# Altium schematic sheet XTIDA-010086_Bias Power Supply.SchDoc: Control card (part 2 of 2)
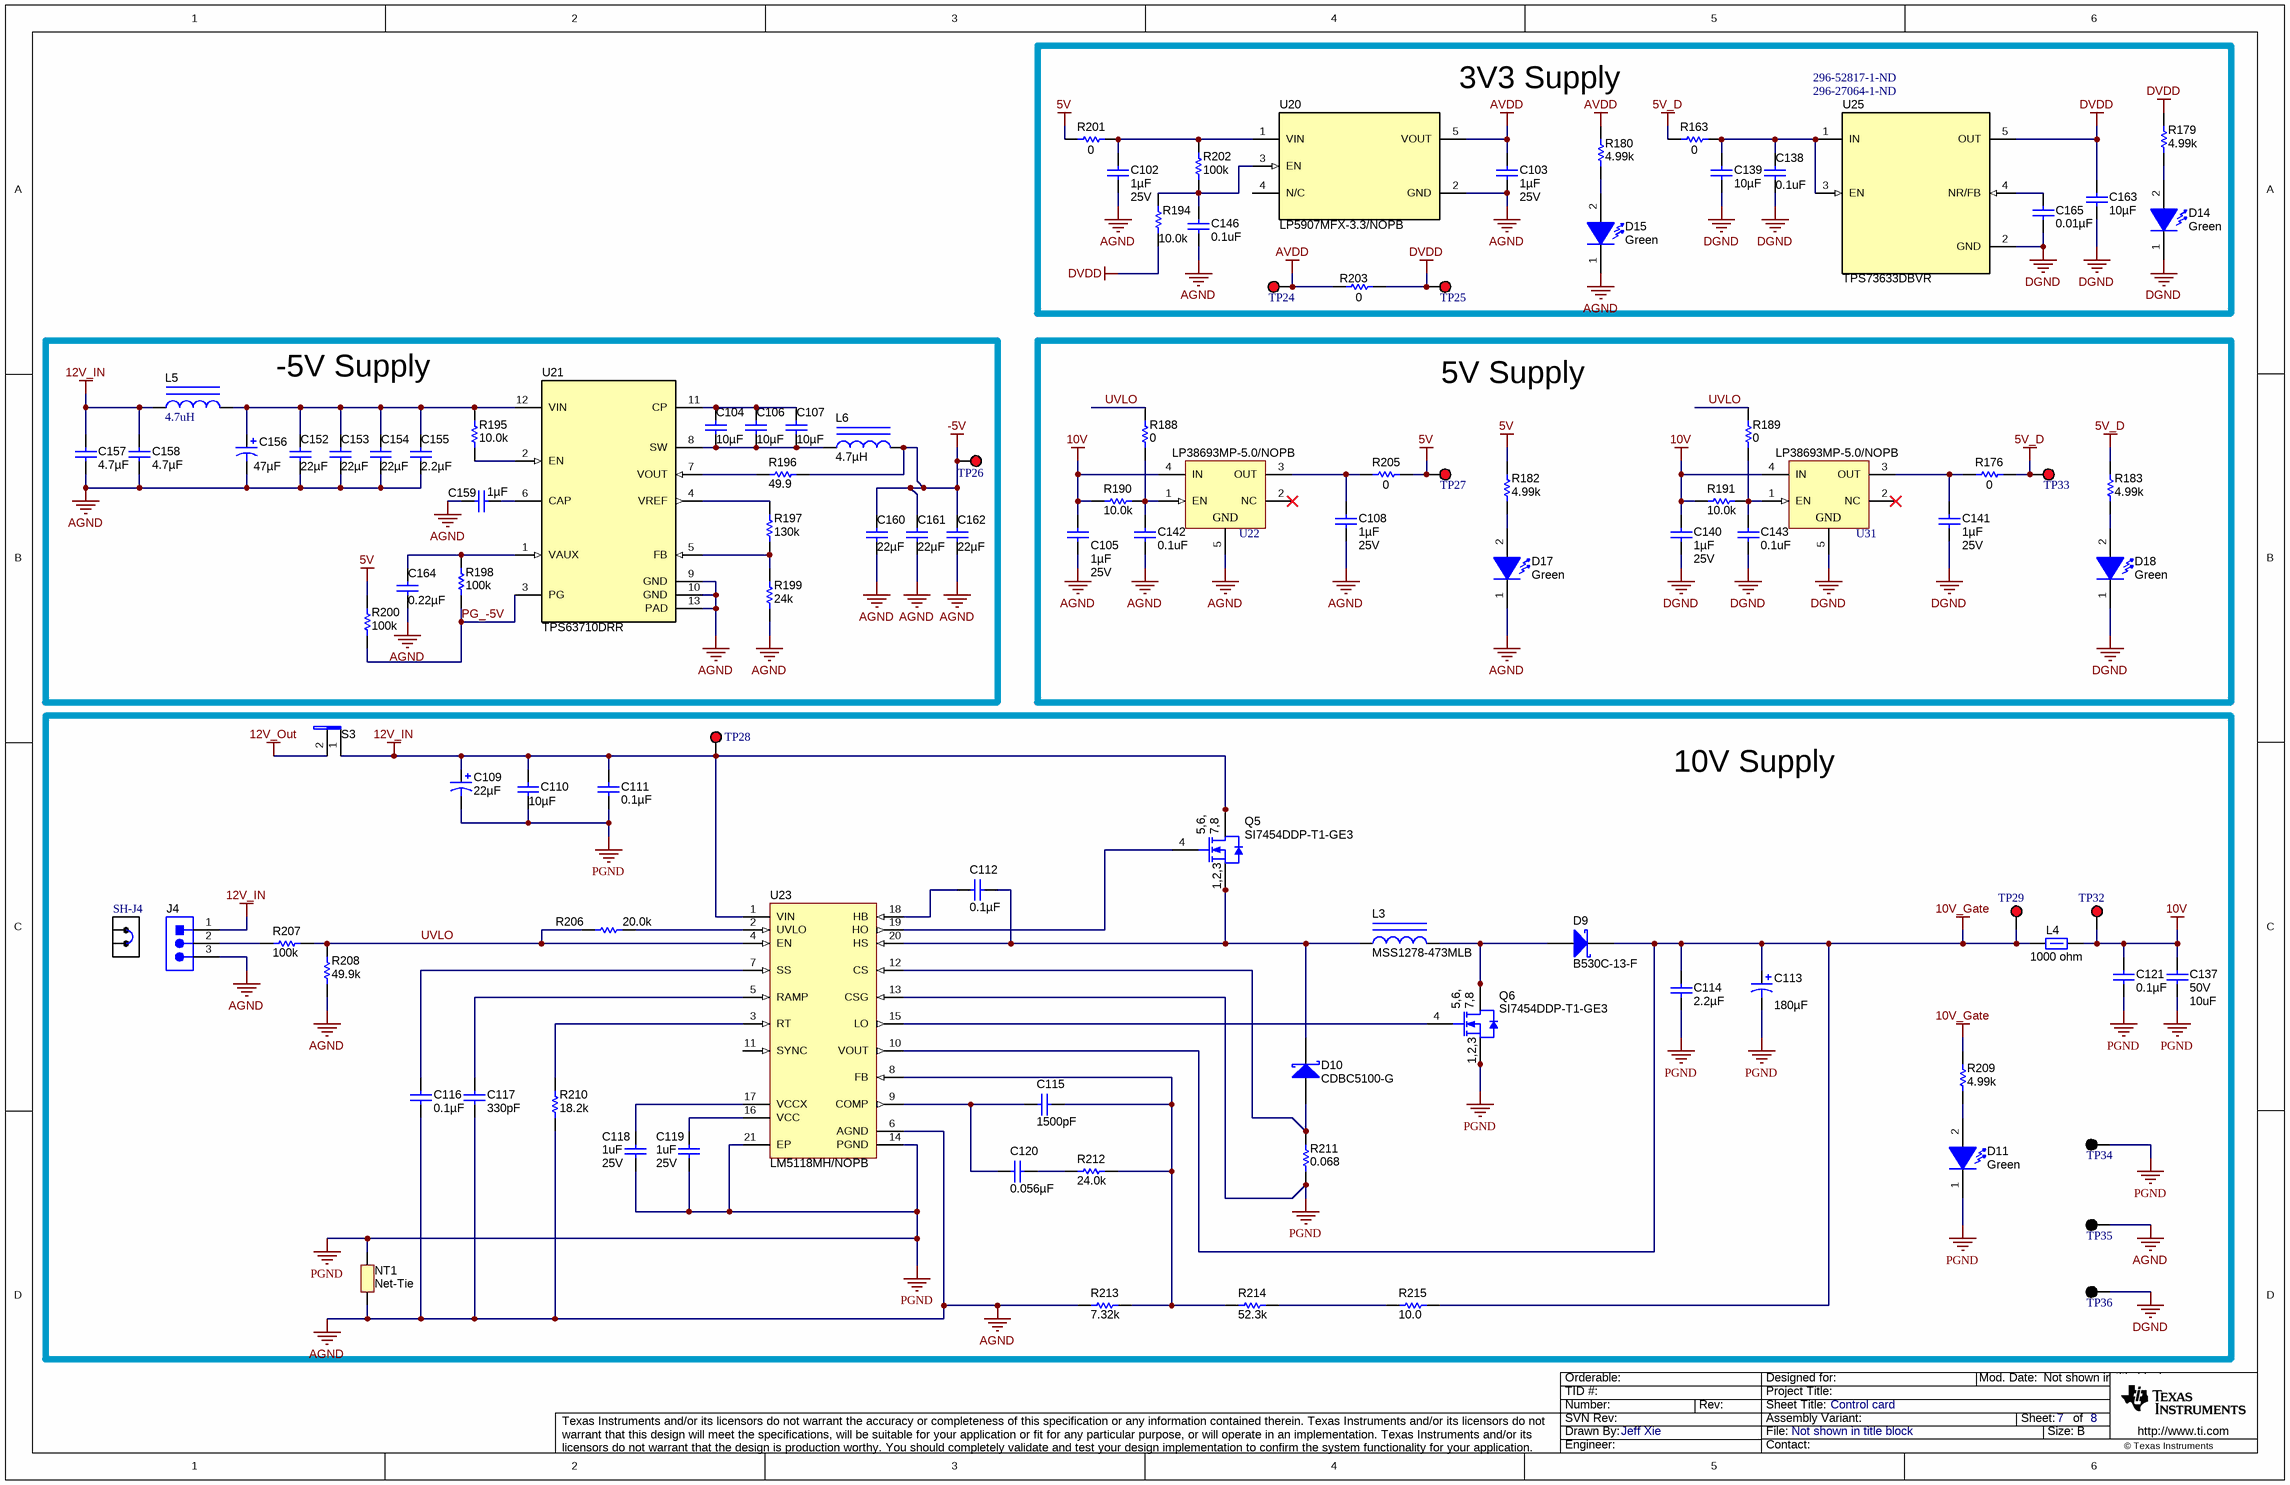
[diagram p1: XTIDA-010086_Bias Power Supply.SchDoc]

## Library data of the parts
C102 C103 C105 C108 C140 C141 = Capacitor: CAP, CERM, 1 uF, 25 V, +/- 10%, X7R, 0603; Manufacturer: MuRata; TaMin_C: -55°C; Polarized: N; SizeAreaWB_mm2: 4.68; Value1: Unknown; U/M: EA; Value: 1uF; TaMax_C: 125°C; SizeZ_mm: 1; SizeX_mm: 1.6; SizeY_mm: 0.8; SizeArea_mm2: 1.28; AEC Category: Q200; ComponentLink1URL: http://search.murata.co.jp/Ceramy/PnsearchViewAction.do?HnOFG=ON&HnNFG=ON&SEL_CNT=50&sLang=en&sKey=GRM188R71E105KA12D&x=9&y=9&search=startwith; Supplier Part Number 2: 81-GRM188R71E105KA2D; Publisher: Texas Instruments; Supplier 2: Mouser; Supplier Part Number 3: 1735540; TempCo: X7R; Supplier 3: Farnell; Published: 2008-06-19; RoHS: Y; MountType: SMT; Supplier 1: Digi-Key; PackageReference: 0603; Tolerance_%: 10%; Cap_Case: 0603; Value2: 25V; CompType: Capacitor; LatestRevisionDate: 2017-03-09; PartNumber: GRM188R71E105KA12D; AEC Qualified: ?; ComponentLink1Description: Datasheet link; Supplier Part Number 1: 490-5307-1-ND; Technology: Ceramic; ValueDisplayed: 1uF
C104 C106 C107 = EMK212BB7106MG-T: CAP, CERM, 10 µF, 16 V, +/- 20%, X7R, 0805; Manufacturer: Taiyo Yuden; Polarized: N; CompType: Capacitor; Value: 10uF; U/M: EA; Cap_F: 0.00001; Tolerance_%: 20; Value1: Unknown; VDC_V: 16; Value2: 16V; TaMin_C: -55; TaMax_C: 125; Cap_Case: 0805; AEC Category: Q200; SymbolVersion: 2008-07-09; PartNumber: EMK212BB7106MG-T; PackageReference: 0805; RoHS: Y; MountType: SMT; Technology: Ceramic; TempCo: X7R; Published: 2008-06-19; Publisher: Texas Instruments; LatestRevisionDate: 2016-03-15; ComponentLink1Description: Datasheet link; ComponentLink1URL: http://www.yuden.co.jp/productdata/catalog/en/mlcc_all_e.pdf; Supplier 1: Digi-Key; Supplier Part Number 1: 587-3319-1-ND; Supplier 2: Mouser; Supplier Part Number 2: 963-EMK212BB7106MG-T; AEC Qualified: ?
C109 = EMVH101ADA220MJA0G: CAP, AL, 22 µF, 100 V, +/- 20%, 0.55 ohm, SMD; Manufacturer: Chemi-Con; Polarized: Y; CompType: Capacitor; Value: 22uF; U/M: EA; Cap_F: 0.000022; Tolerance_%: 20; VDC_V: 100; Value2: 100V; ESR_ohm: 0.55; IRMS_A: 0.115; TaMin_C: -40; TaMax_C: 125; Cap_Case: JA0; SymbolVersion: 2008-07-09; PartNumber: EMVH101ADA220MJA0G; PackageReference: JA0; RoHS: Y; Value1: 0.55 ohm; MountType: SMT; Technology: AL; Series: MVH; Publisher: Texas Instruments; LatestRevisionDate: 2014-11-05; ComponentLink1Description: Datasheet link; ComponentLink1URL: http://www.chemi-con.co.jp/e/catalog/pdf/al-e/al-sepa-e/003-chip/al-mvh-e-111201.pdf; Supplier 1: Digi-Key; Supplier Part Number 1: 565-2341-1-ND; Supplier 2: Mouser; Supplier Part Number 2: 661-MVH100V220M; Supplier 3: Farnell; Supplier Part Number 3: 1698521
C110 = C5750X7S2A106M230KB: CAP, CERM, 10 µF, 100 V, +/- 20%, X7S,; Manufacturer: TDK; Polarized: N; CompType: Capacitor; Value: 10uF; U/M: EA; Cap_F: 0.00001; Tolerance_%: 20; ESR_ohm: 0.005; Value1: 0.005 ohm; VDC_V: 100; Value2: 100V; IRMS_A: 6.45; TaMin_C: -55; TaMax_C: 125; Cap_Case: 2220; SizeArea_mm2: 28.5; SizeAreaWB_mm2: 53.9; SizeX_mm: 5.7; SizeY_mm: 5; SizeZ_mm: 2.5; AEC Category: Q200; SymbolVersion: 2008-07-09; PartNumber: C5750X7S2A106M230KB; RoHS: Y; MountType: SMT; Technology: Ceramic; TempCo: X7S; Published: 2008-06-19; Publisher: Texas Instruments; LatestRevisionDate: 2016-08-21; ComponentLink1Description: Datasheet link; ComponentLink1URL: http://product.tdk.com/en/catalog/datasheets/mlcc_commercial_midvoltage_en.pdf; Supplier 1: Digi-Key; Supplier Part Number 1: 445-5212-1-ND; Supplier 2: Mouser; Supplier Part Number 2: 810-C5750X7S2A106M; Supplier 3: Farnell; Supplier Part Number 3: 2363568; AEC Qualified: N; AEC Grade: N/A
C111 C121 = C2012X7R2A104K125AA: CAP, CERM, 0.1 µF, 100 V, +/- 10%, X7R, 0805; Manufacturer: TDK; Polarized: N; CompType: Capacitor; Value: 0.1uF; U/M: EA; Cap_F: 0.0000001; Tolerance_%: 10; ESR_ohm: 0.020726; Value1: 0.020726 ohm; VDC_V: 100; Value2: 100V; IRMS_A: 1.456; TaMin_C: -55; TaMax_C: 125; Cap_Case: 0805; SizeArea_mm2: 2.5; SizeAreaWB_mm2: 6.75; SizeX_mm: 2; SizeY_mm: 1.25; SizeZ_mm: 1.45; AEC Category: Q200; SymbolVersion: 2008-07-09; PartNumber: C2012X7R2A104K125AA; PackageReference: 0805; RoHS: Y; MountType: SMT; Technology: Ceramic; TempCo: X7R; Published: 2008-06-19; Publisher: Texas Instruments; LatestRevisionDate: 2016-10-19; ComponentLink1Description: Datasheet link; ComponentLink1URL: https://product.tdk.com/en/search/capacitor/ceramic/mlcc/info?part_no=C2012X7R2A104K125AA; Supplier 1: Digi-Key; Supplier Part Number 1: 445-1418-1-ND; Supplier 2: Farnell; Supplier Part Number 2: 1844410; AEC Qualified: N; AEC Grade: N/A
C112 C116 = GRM188R72A104KA35D: CAP, CERM, 0.1 µF, 100 V, +/- 10%, X7R, 0603; Manufacturer: MuRata; Polarized: N; CompType: Capacitor; Value: 0.1uF; U/M: EA; Cap_F: 0.0000001; Tolerance_%: 10; Value1: Unknown; VDC_V: 100; Value2: 100V; TaMin_C: -55; TaMax_C: 125; Cap_Case: 0603; AEC Category: Q200; SymbolVersion: 2008-07-09; PartNumber: GRM188R72A104KA35D; PackageReference: 0603; RoHS: Y; MountType: SMT; Technology: Ceramic; TempCo: X7R; Published: 2008-06-19; Publisher: Texas Instruments; LatestRevisionDate: 2015-12-07; ComponentLink1Description: Datasheet link; ComponentLink1URL: http://search.murata.co.jp/Ceramy/PnsearchViewAction.do?HnOFG=ON&HnNFG=ON&SEL_CNT=50&sLang=en&sKey=GRM188R72A104KA35D&x=9&y=9&search=startwith; Supplier 1: Digi-Key; Supplier Part Number 1: 490-3285-1-ND; Supplier 2: Mouser; Supplier Part Number 2: 81-GRM188R72A104KA35; Supplier 3: Farnell; Supplier Part Number 3: 1828921; AEC Qualified: ?
C113 = APXA160ARA181MHC0G: CAP, Aluminum Polymer, 180 µF, 16 V, +/- 20%, 0.016 ohm, HC0 SMD; Manufacturer: Chemi-Con; Polarized: Y; CompType: Capacitor; Value: 180uF; U/M: EA; Cap_F: 0.00018; Tolerance_%: 20; VDC_V: 16; Value2: 16V; ESR_ohm: 0.016; IRMS_A: 4.36; TaMin_C: -55; TaMax_C: 105; SizeAreaWB_mm2: 110.25; SizeArea_mm2: 72.25; SizeX_mm: 8.5; SizeZ_mm: 12.3; AEC Category: Q200; AEC Qualified: N; SymbolVersion: 2008-07-09; PartNumber: APXA160ARA181MHC0G; PackageReference: HC0; RoHS: Y; Value1: 0.016 ohm; MountType: SMT; Technology: Aluminum Polymer; Series: PXA; Cap_Case: HC0; SizeY_mm: 8.5; Publisher: Texas Instruments; LatestRevisionDate: 2016-09-12; ComponentLink1Description: Datasheet link; ComponentLink1URL: http://www.chemi-con.co.jp/cgi-bin/CAT_DB/SEARCH/cat_db_al.cgi?e=e&j=p&pdfname=pxa; Supplier 1: Digi-Key; Supplier Part Number 1: 565-3078-1-ND; Supplier 2: Mouser; Supplier Part Number 2: 661-PXA16VC181MH; AEC Grade: N/A
C114 = C2012X7R1C225K125AB: CAP, CERM, 2.2 µF, 16 V, +/- 10%, X7R, 0805; Manufacturer: TDK; Polarized: N; CompType: Capacitor; Value: 2.2uF; U/M: EA; Cap_F: 0.0000022; Tolerance_%: 10; ESR_ohm: 0.0049; Value1: 0.0049 ohm; VDC_V: 16; Value2: 16V; TaMin_C: -55; TaMax_C: 125; Cap_Case: 0805; AEC Category: Q200; SymbolVersion: 2008-07-09; PartNumber: C2012X7R1C225K125AB; PackageReference: 0805; RoHS: Y; MountType: SMT; Technology: Ceramic; TempCo: X7R; Published: 2008-06-19; Publisher: Texas Instruments; LatestRevisionDate: 2016-03-26; ComponentLink1Description: Datasheet link; ComponentLink1URL: http://www.tdk.co.jp/tefe02/e412_c.pdf; Supplier 1: Digi-Key; Supplier Part Number 1: 445-1420-1-ND; Supplier 2: Mouser; Supplier Part Number 2: 810-C2012X7R1C225K; Supplier 3: Farnell; Supplier Part Number 3: 1907345; AEC Qualified: ?
C115 = GRM1885C2A152JA01D: CAP, CERM, 1500 pF, 100 V, +/- 5%, C0G/NP0, 0603; Manufacturer: MuRata; Polarized: N; CompType: Capacitor; Value: 1500pF; U/M: EA; Cap_F: 0.0000000015; Tolerance_%: 5; Value1: Unknown; VDC_V: 100; Value2: 100V; TaMin_C: -55; TaMax_C: 125; Cap_Case: 0603; SymbolVersion: 2008-07-09; PartNumber: GRM1885C2A152JA01D; PackageReference: 0603; RoHS: Y; MountType: SMT; Technology: Ceramic; TempCo: C0G/NP0; Published: 2008-06-19; Publisher: Texas Instruments; LatestRevisionDate: 2014-11-05; ComponentLink1Description: Datasheet link; ComponentLink1URL: http://search.murata.co.jp/Ceramy/PnsearchViewAction.do?HnOFG=ON&HnNFG=ON&SEL_CNT=50&sLang=en&sKey=GRM1885C2A152JA01D&x=9&y=9&search=startwith
C117 = C1608C0G2A331J080AA: CAP, CERM, 330 pF, 100 V, +/- 5%, C0G/NP0, 0603; Manufacturer: TDK; Polarized: N; CompType: Capacitor; Value: 330pF; U/M: EA; Cap_F: 0.00000000033; Tolerance_%: 5; ESR_ohm: 0.1269; Value1: 0.1269 ohm; VDC_V: 100; Value2: 100V; TaMin_C: -55; TaMax_C: 125; Cap_Case: 0603; AEC Category: Q200; SymbolVersion: 2008-07-09; PartNumber: C1608C0G2A331J080AA; PackageReference: 0603; RoHS: Y; MountType: SMT; Technology: Ceramic; TempCo: C0G/NP0; Published: 2008-06-19; Publisher: Texas Instruments; LatestRevisionDate: 2016-03-26; ComponentLink1Description: Datasheet link; ComponentLink1URL: http://www.tdk.co.jp/tefe02/e412_c.pdf; Supplier 1: Digi-Key; Supplier Part Number 1: 445-2309-1-ND; Supplier 2: Mouser; Supplier Part Number 2: 810-C1608C0G2A331J; Supplier 3: Newark; Supplier Part Number 3: 87R3569; AEC Qualified: ?
C118 C119 = Capacitor: CAP, CERM, 1 uF, 25 V, +/- 10%, X7R, 0603; Manufacturer: MuRata; Polarized: N; Value: 1uF; U/M: EA; Cap_F: 1µF; Value1: Unknown; TaMin_C: -55°C; TaMax_C: 125°C; AEC Category: Q200; SizeArea_mm2: 1.28; SizeAreaWB_mm2: 4.68; SizeX_mm: 1.6; SizeY_mm: 0.8; SizeZ_mm: 1; CompType: Capacitor; PartNumber: GRM188R71E105KA12D; PackageReference: 0603; RoHS: Y; Tolerance_%: 10%; Value2: 25V; MountType: SMT; Technology: Ceramic; TempCo: X7R; Cap_Case: 0603; Published: 2008-06-19; Publisher: Texas Instruments; LatestRevisionDate: 2017-03-09; ComponentLink1Description: Datasheet link; ComponentLink1URL: http://search.murata.co.jp/Ceramy/PnsearchViewAction.do?HnOFG=ON&HnNFG=ON&SEL_CNT=50&sLang=en&sKey=GRM188R71E105KA12D&x=9&y=9&search=startwith; Supplier 1: Digi-Key; Supplier Part Number 1: 490-5307-1-ND; Supplier 2: Mouser; Supplier Part Number 2: 81-GRM188R71E105KA2D; Supplier 3: Farnell; Supplier Part Number 3: 1735540; AEC Qualified: ?
C120 = GRM188R71H563KA93D: CAP, CERM, 0.056 µF, 50 V, +/- 10%, X7R, 0603; Manufacturer: MuRata; Polarized: N; CompType: Capacitor; Value: 0.056uF; U/M: EA; Cap_F: 0.000000056; Tolerance_%: 10; Value1: Unknown; VDC_V: 50; Value2: 50V; TaMin_C: -55; TaMax_C: 125; Cap_Case: 0603; SymbolVersion: 2008-07-09; PartNumber: GRM188R71H563KA93D; PackageReference: 0603; RoHS: Y; MountType: SMT; Technology: Ceramic; TempCo: X7R; Published: 2008-06-19; Publisher: Texas Instruments; LatestRevisionDate: 2014-11-05; ComponentLink1Description: Datasheet link; ComponentLink1URL: http://search.murata.co.jp/Ceramy/PnsearchViewAction.do?HnOFG=ON&HnNFG=ON&SEL_CNT=50&sLang=en&sKey=GRM188R71H563KA93D&x=9&y=9&search=startwith; Supplier 1: Mouser; Supplier Part Number 1: 81-GRM188R71H563KA93
C137 = Capacitor: CAP, CERM, 10 uF, 50 V, +/- 20%, X7R, 1210; Manufacturer: TDK; TaMin_C: -55°C; Polarized: N; SizeAreaWB_mm2: 14.7; Value1: Unknown; U/M: EA; Value: 10uF; TaMax_C: 125°C; SizeZ_mm: 2.8; SizeX_mm: 3.2; SizeY_mm: 2.5; Cap_Case: 1210; SizeArea_mm2: 8; Cap_F: 10µF; AEC Category: Q200; ComponentLink1URL: http://product.tdk.com/en/catalog/datasheets/mlcc_commercial_general_en.pdf; Supplier Part Number 2: 29X4867; Publisher: Texas Instruments; Supplier 2: Newark; Supplier Part Number 3: 810-C3225X7R1H106MAC; TempCo: X7R; Supplier 3: Mouser; Published: 2008-06-19; RoHS: Y; MountType: SMT; Supplier 1: Digi-Key; PackageReference: 1210; Tolerance_%: 20%; Value2: 50V; CompType: Capacitor; LatestRevisionDate: 2017-03-09; PartNumber: C3225X7R1H106M250AC; AEC Qualified: ?; ComponentLink1Description: Datasheet link; Supplier Part Number 1: 445-14933-1-ND; Technology: Ceramic
C138 C142 C143 C146 = Capacitor: CAP, CERM, 0.1 uF, 25 V, +/- 5%, X7R, 0603; Manufacturer: AVX; Polarized: N; Value: 0.1uF; U/M: EA; Cap_F: 100nF; ESR_ohm: 0.05; Value1: 0.05 ohm; VDC_V: 25V; TaMin_C: -55°C; TaMax_C: 125°C; AEC Category: Q200; SizeArea_mm2: 1.28; SizeAreaWB_mm2: 4.68; SizeX_mm: 1.6; SizeY_mm: 0.8; SizeZ_mm: 1; CompType: Capacitor; PartNumber: 06033C104JAT2A; PackageReference: 0603; RoHS: Y; Tolerance_%: 5%; Value2: 25V; MountType: SMT; Technology: Ceramic; TempCo: X7R; Cap_Case: 0603; Published: 2008-06-19; Publisher: Texas Instruments; LatestRevisionDate: 2017-03-09; ComponentLink1Description: Datasheet link; ComponentLink1URL: http://datasheets.avx.com/X7RDielectric.pdf; Supplier 1: Digi-Key; Supplier Part Number 1: 478-3713-1-ND; Supplier 2: Mouser; Supplier Part Number 2: 581-06033C104JAT2A; Supplier 3: Farnell; Supplier Part Number 3: 1740614; AEC Qualified: N; AEC Grade: N/A
C139 C163 = GRM188R61E106MA73D: CAP, CERM, 10 µF, 25 V,+/- 20%, X5R, 0603; Manufacturer: MuRata; Polarized: N; CompType: Capacitor; Value: 10uF; U/M: EA; Cap_F: 0.00001; Tolerance_%: 20; VDC_V: 25; Value2: 25V; TaMin_C: -55; TaMax_C: 85; SizeArea_mm2: 1.28; SizeAreaWB_mm2: 4.68; SizeX_mm: 1.6; SizeY_mm: 0.8; SizeZ_mm: 1; AEC Category: Q200; Green_Lifecycle: Active; Green_REACh: Passed; SymbolVersion: 2008-07-09; PartNumber: GRM188R61E106MA73D; PackageReference: 0603; RoHS: Y; MountType: SMT; Technology: Ceramic; TempCo: X5R; Cap_Case: 0603; Published: 2008-06-19; Publisher: Texas Instruments; LatestRevisionDate: 2017-06-22; ComponentLink1Description: Datasheet link; ComponentLink1URL: http://psearch.murata.com/capacitor/product/GRM188R61E106MA73%23.pdf; Supplier 1: Digi-Key; Supplier Part Number 1: 490-7202-1-ND; Supplier 2: Mouser; Supplier Part Number 2: 81-GRM188R61E106MA3L; Supplier 3: Farnell; Supplier Part Number 3: 1828803RL; AEC Qualified: ?; Green_EU RoHS: Passed; Green_EU RoHS-2: Incomplete
C152-C154 = EMK316BB7226ML-T: CAP, CERM, 22 µF, 16 V, +/- 20%, X7R, 1206_190; Manufacturer: Taiyo Yuden; Polarized: N; CompType: Capacitor; Value: 22uF; U/M: EA; Cap_F: 0.000022; Tolerance_%: 20; Value1: Unknown; VDC_V: 16; Value2: 16V; TaMin_C: -55; TaMax_C: 125; Cap_Case: 1206; SizeArea_mm2: 5.12; SizeAreaWB_mm2: 10.92; SizeX_mm: 3.2; SizeY_mm: 1.6; SizeZ_mm: 1.9; AEC Category: Q200; SymbolVersion: 2008-07-09; PartNumber: EMK316BB7226ML-T; PackageReference: 1206_190; RoHS: Y; MountType: SMT; Technology: Ceramic; TempCo: X7R; Published: 2008-06-19; Publisher: Texas Instruments; LatestRevisionDate: 2016-09-27; ComponentLink1Description: Datasheet link; ComponentLink1URL: http://www.yuden.co.jp/productdata/catalog/en/mlcc_all_e.pdf; Supplier 1: Digi-Key; Supplier Part Number 1: 587-4319-1-ND; Supplier 2: Mouser; Supplier Part Number 2: 963-EMK316BB7226ML-T; Supplier 3: Newark; Supplier Part Number 3: 52Y4678; AEC Qualified: N; AEC Grade: N/A
C155 = EMK107BB7225KA-T: CAP, CERM, 2.2 µF, 16 V, +/- 10%, X7R, 0603; Manufacturer: Taiyo Yuden; Polarized: N; CompType: Capacitor; Value: 2.2uF; U/M: EA; Cap_F: 0.0000022; Tolerance_%: 10; Value1: Unknown; VDC_V: 16; Value2: 16V; TaMin_C: -55; TaMax_C: 125; Cap_Case: 0603; AEC Category: Q200; SymbolVersion: 2008-07-09; PartNumber: EMK107BB7225KA-T; PackageReference: 0603; RoHS: Y; MountType: SMT; Technology: Ceramic; TempCo: X7R; Published: 2008-06-19; Publisher: Texas Instruments; LatestRevisionDate: 2016-03-15; ComponentLink1Description: Datasheet link; ComponentLink1URL: http://www.yuden.co.jp/productdata/catalog/en/mlcc_all_e.pdf; Supplier 1: Digi-Key; Supplier Part Number 1: EMK107BB7225KA-T-ND; Supplier 2: Mouser; Supplier Part Number 2: 963-EMK107BB7225KA-T; Supplier 3: Newark; Supplier Part Number 3: 68X1300; AEC Qualified: N; AEC Grade: N/A
C156 = F951C476MBAAQ2: CAP, TA, 47 µF, 16 V, +/- 20%, 0.6 ohm, SMD; Manufacturer: AVX; Polarized: Y; CompType: Capacitor; Value: 47uF; U/M: EA; Cap_F: 0.000047; Tolerance_%: 20; Value1: 0.6 ohm; VDC_V: 16; Value2: 16V; ESR_ohm: 0.6; TaMin_C: -55; TaMax_C: 125; SizeAreaWB_mm2: 17.1; SizeArea_mm2: 9.8; SizeX_mm: 3.5; SizeY_mm: 2.8; SizeZ_mm: 2; AEC Category: Q200; SymbolVersion: 2008-07-09; PartNumber: F951C476MBAAQ2; PackageReference: 3528; RoHS: Y; MountType: SMT; Technology: TA; Series: F95; Cap_Case: F95_B; Publisher: Texas Instruments; LatestRevisionDate: 2016-09-02; LatestRevisionNote: Updated supplier links; ComponentLink1Description: Datasheet link; ComponentLink1URL: http://www.avx.com/docs/Catalogs/f95.pdf; Supplier 1: Digi-Key; Supplier Part Number 1: 478-8478-1-ND; Supplier 2: Mouser; Supplier Part Number 2: 647-F951C476MBAAQ2; Supplier 3: Farnell; Supplier Part Number 3: 1853428; AEC Qualified: ?
C157 C158 = GRM319R61E475KA12D: CAP, CERM, 4.7 µF, 25 V,+/- 10%, X5R, 1206; Manufacturer: MuRata; Polarized: N; CompType: Capacitor; Value: 4.7uF; U/M: EA; Cap_F: 0.0000047; Tolerance_%: 10; ESR_ohm: 0.006; Value1: 0.006 ohm; VDC_V: 25; Value2: 25V; TaMin_C: -55; TaMax_C: 85; SizeArea_mm2: 5.12; SizeAreaWB_mm2: 10.92; SizeX_mm: 3.2; SizeY_mm: 1.6; SizeZ_mm: 1.35; AEC Category: Q200; SymbolVersion: 2008-07-09; PartNumber: GRM319R61E475KA12D; PackageReference: 1206; RoHS: Y; MountType: SMT; Technology: Ceramic; TempCo: X5R; Cap_Case: 1206; Published: 2008-06-19; Publisher: Texas Instruments; LatestRevisionDate: 2017-06-22; ComponentLink1Description: Datasheet link; ComponentLink1URL: http://search.murata.co.jp/Ceramy/PnsearchViewAction.do?HnOFG=ON&HnNFG=ON&SEL_CNT=50&sLang=en&sKey=GRM319R61E475KA12D&x=9&y=9&search=startwith; Supplier 1: Digi-Key; Supplier Part Number 1: 490-3372-1-ND; Supplier 2: Mouser; Supplier Part Number 2: 81-GRM426X475K25D; Supplier 3: Farnell; Supplier Part Number 3: 1845758; AEC Qualified: ?
C159 = C1005X5R1C105K050BC: CAP, CERM, 1 µF, 16 V,+/- 10%, X5R, 0402; Manufacturer: TDK; Polarized: N; CompType: Capacitor; Value: 1uF; U/M: EA; Cap_F: 0.000001; Tolerance_%: 10; VDC_V: 16; Value2: 16V; TaMin_C: -55; TaMax_C: 85; SizeArea_mm2: 0.5; SizeAreaWB_mm2: 3; SizeX_mm: 1; SizeZ_mm: 0.6; AEC Category: Q200; Green_Lifecycle: EOL; Green_REACh: Passed; SymbolVersion: 2008-07-09; PartNumber: C1005X5R1C105K050BC; PackageReference: 0402; RoHS: Y; MountType: SMT; Technology: Ceramic; TempCo: X5R; Cap_Case: 0402; SizeY_mm: 0.5; Published: 2008-06-19; Publisher: Texas Instruments; LatestRevisionDate: 2017-06-22; ComponentLink1Description: Datasheet link; ComponentLink1URL: https://product.tdk.com/info/en/catalog/datasheets/mlcc_commercial_general_en.pdf; Supplier 1: Digi-Key; Supplier Part Number 1: 445-4978-1-ND; Supplier 2: Newark; Supplier Part Number 2: 90R7590; AEC Qualified: N; AEC Grade: N/A; Green_EU RoHS: Passed; Green_EU RoHS-2: Passed
C160-C162 = C2012X7S1A226M125AC: CAP, CERM, 22 µF, 10 V, +/- 20%, X7S, 0805; Manufacturer: TDK; Polarized: N; CompType: Capacitor; Value: 22uF; U/M: EA; Cap_F: 0.000022; Tolerance_%: 20; Value1: Unknown; VDC_V: 10; Value2: 10V; TaMin_C: -55; TaMax_C: 125; Cap_Case: 0805; AEC Category: Q200; SymbolVersion: 2008-07-09; PartNumber: C2012X7S1A226M125AC; PackageReference: 0805; RoHS: Y; MountType: SMT; Technology: Ceramic; TempCo: X7S; Published: 2008-06-19; Publisher: Texas Instruments; LatestRevisionDate: 2016-03-15; ComponentLink1Description: Datasheet link; ComponentLink1URL: http://product.tdk.com/en/catalog/datasheets/mlcc_commercial_general_en.pdf; Supplier 1: Digi-Key; Supplier Part Number 1: 445-14560-1-ND; AEC Qualified: N; AEC Grade: N/A
C164 = GRM155R71C224KA12D: CAP, CERM, 0.22 µF, 16 V,+/- 10%, X7R, 0402; Manufacturer: MuRata; Polarized: N; CompType: Capacitor; Value: 0.22uF; U/M: EA; Cap_F: 0.00000022; Tolerance_%: 10; VDC_V: 16; Value2: 16V; TaMin_C: -55; TaMax_C: 125; SizeArea_mm2: 0.5; SizeAreaWB_mm2: 3; SizeX_mm: 1; SizeZ_mm: 0.6; AEC Category: Q200; Green_Lifecycle: Active; Green_REACh: Passed; SymbolVersion: 2008-07-09; PartNumber: GRM155R71C224KA12D; PackageReference: 0402; RoHS: Y; MountType: SMT; Technology: Ceramic; TempCo: X7R; Cap_Case: 0402; SizeY_mm: 0.5; Published: 2008-06-19; Publisher: Texas Instruments; LatestRevisionDate: 2017-06-22; ComponentLink1Description: Datasheet link; ComponentLink1URL: http://search.murata.co.jp/Ceramy/PnsearchViewAction.do?HnOFG=ON&HnNFG=ON&SEL_CNT=50&sLang=en&sKey=GRM155R71C224KA12D&x=9&y=9&search=startwith; Supplier 1: Digi-Key; Supplier Part Number 1: 490-5418-1-ND; Supplier 2: Mouser; Supplier Part Number 2: 81-GRM155R71C224KA2D; AEC Qualified: ?; Green_EU RoHS: Passed; Green_EU RoHS-2: Incomplete
C165 = 06031C103KAT2A: CAP, CERM, 0.01 µF, 100 V, +/- 10%, X7R, 0603; Manufacturer: AVX; Polarized: N; CompType: Capacitor; Value: 0.01uF; U/M: EA; Cap_F: 0.00000001; Tolerance_%: 10; ESR_ohm: 0.098; Value1: 0.098 ohm; VDC_V: 100; Value2: 100V; TaMin_C: -55; TaMax_C: 125; AEC Category: Q200; SymbolVersion: 2008-07-09; PartNumber: 06031C103KAT2A; PackageReference: 0603; RoHS: Y; MountType: SMT; Technology: Ceramic; TempCo: X7R; Cap_Case: 0603; Published: 2008-06-19; Publisher: Texas Instruments; LatestRevisionDate: 2016-03-31; ComponentLink1Description: Datasheet link; ComponentLink1URL: http://datasheets.avx.com/X7RDielectric.pdf; Supplier 1: Digi-Key; Supplier Part Number 1: 478-1205-1-ND; Supplier 2: Mouser; Supplier Part Number 2: 581-06031C103K; Supplier 3: Farnell; Supplier Part Number 3: 1327671; AEC Qualified: N; AEC Grade: N/A
D9 = B530C-13-F: Diode, Schottky, 30 V, 5 A, SMC; Manufacturer: Diodes Inc.; U/M: EA; Vf_V: 0.55; Value: 30V; Value1: 5A; Value2: 0.55V; Io_A: 5; Vr_V: 30; TJmax_C: 125; RJC_CperW: 10; SymbolVersion: 2008-12-08; PartNumber: B530C-13-F; PackageReference: SMC; CompType: Diode; MountType: SMT; Type: Schottky; RoHS: Y; Published: 2008-06-26; Publisher: Texas Instruments; LatestRevisionDate: 2014-11-05; ComponentLink1Description: Datasheet link; ComponentLink1URL: http://www.diodes.com/datasheets/ds13012.pdf; Supplier 1: Digi-Key; Supplier Part Number 1: B530C-FDICT-ND; Supplier 2: Mouser; Supplier Part Number 2: 621-B530C-13-F; Supplier 3: Farnell; Supplier Part Number 3: 1843766
D10 = CDBC5100-G: Diode, Schottky, 100 V, 5 A, SMC; Manufacturer: Comchip Technology; U/M: EA; Vf_V: 0.85; Value: 100V; Value1: 5A; Value2: 0.85V; Io_A: 5; Vr_V: 100; TJmax_C: 125; SymbolVersion: 2008-12-08; PartNumber: CDBC5100-G; PackageReference: SMC; CompType: Diode; MountType: SMT; Type: Schottky; RoHS: Y; Published: 2008-06-26; Publisher: Texas Instruments; LatestRevisionDate: 2014-11-05; ComponentLink1Description: Datasheet link; ComponentLink1URL: http://www.comchip.com.tw/cms/UserFiles/QW-BB012%20CDBC520-G%7E5100-G%20RevC809622.pdf; Supplier 1: Digi-Key; Supplier Part Number 1: 641-1124-1-ND; Supplier 2: Mouser; Supplier Part Number 2: 750-CDBC5100-G
D11 D14 D15 D17 D18 = 150060VS75000: LED, Green, SMD; Manufacturer: Wurth Elektronik; Type: AlInGaP; Vf_V: 2; Value2: 2V; Io_A: 0.02; Value1: W; U/M: EA; CompType: LED; PartNumber: 150060VS75000; SymbolVersion: 2008-11-06; MountType: SMT; RoHS: Y; PackageReference: LED_0603; Color: green; Published: 2008-07-11; Publisher: Texas Instruments; ComponentLink1URL: http://katalog.we-online.de/led/datasheet/150060VS75000.pdf; ComponentLink1Description: Datasheet link; LatestRevisionDate: 2016-01-08; Supplier 1: Digi-Key; Supplier Part Number 1: 732-4980-1-ND
J4 = 0022284033: Header, 2.54mm, 3x1, Tin, TH; Manufacturer: Molex; SymbolCreator: a0799628; Pitch_mm: 2.54; Gender: Male; Shrouded: N; Row_Count: 1; Current_A: 4; Voltage_V: 250; Cert_UL: Y; SymbolVersion: 2013-03-28; PartNumber: 0022284033; PackageReference: Header, 2.54mm, 3x1, TH; ClassName: Header; CompType: Header; RoHS: Y; MountType: TH; ComponentLink1Description: Datasheet URL; ComponentLink1URL: http://www.molex.com/pdm_docs/sd/022284033_sd.pdf; Orientation: Vertical; PinCount: 3; ContactFinish: Tin; Color: Black; Publisher: Texas Instruments; LatestRevisionDate: 2017-06-22; Supplier 1: Digi-Key; Supplier Part Number 1: WM50016-03-ND
L3 = MSS1278-473MLB: Inductor, Shielded Drum Core, Ferrite, 47 µH, 2.9 A, 0.07 ohm, SMD; Manufacturer: Coilcraft; Value: 47uH; Ind_H: 47.0E-6; ValueDisplayed: 47µH; Imax_A: 2.9; Irms: 2.9A @ 40C rise; Isat: 5.32A @ 30% inductance drop; DCR_ohm: 0.07; Value2: 2.9A; SymbolVersion: 2008-07-23; CompType: Inductor; PartNumber: MSS1278-473MLB; Value1: 0.07 ohm; Technology: Shielded Drum Core; MountType: SMT; Material: Ferrite; PackageReference: MSS1278; Published: 2008-06-26; Publisher: Texas Instruments; LatestRevisionDate: 2014-10-31; ComponentLink1Description: Datasheet link; ComponentLink1URL: http://www.coilcraft.com/pdfs/mss1278.pdf; RoHS: Y
L4 = CMP-0003369-1: Ferrite Bead, 1000 ohm @ 100 MHz, 1.5 A, 1806; Manufacturer: MuRata; ZTyp@100MHz_Ohm: 1k; SizeAreaWB_mm2: 14.3; DCR_ohm: 0.09; Value1: 0.09 ohm; Imax_A: 1.5A; SizeZ_mm: 1.85; SizeX_mm: 4.5; SizeY_mm: 1.6; SizeArea_mm2: 7.2; ComponentLink1URL: http://search.murata.co.jp/Ceramy/image/img/PDF/ENG/L0110S0100BLM41P.pdf; Supplier Part Number 2: 81-BLM41PG102SN1L; Publisher: Texas Instruments; Supplier 2: Mouser; Published: 2014-04-30; RoHS: Y; MountType: SMT; Supplier 1: Digi-Key; PackageReference: 1806; Value2: 1.5A; CompType: Ferrite Bead; LatestRevisionDate: 2017-03-09; PartNumber: BLM41PG102SN1L; ComponentLink1Description: Datasheet link; Supplier Part Number 1: 490-1061-1-ND; ValueDisplayed: 1000 ohm
L5 = Inductor_Iron: Inductor, Wirewound, 4.7 uH, 0.95 A, 0.38 ohm, SMD; Manufacturer: Taiyo Yuden; Isat: 1A @ 30% inductance drop; Irms: 0.95A @ 40C rise; Green_Lifecycle: Active; SizeAreaWB_mm2: 7.8; DCR_ohm: 0.38; Green_REACh: Passed; Value: 4.7uH; Imax_A: 950mA; SizeZ_mm: 1; SizeX_mm: 2; SizeY_mm: 1.6; Value2: 0.95A; SizeArea_mm2: 3.2; Ind_H: 4.7µH; AEC Category: Q200; ComponentLink1URL: http://www.yuden.co.jp/productdata/catalog/en/wound10_e.pdf; Publisher: Texas Instruments; Published: 2008-06-26; RoHS: Y; Value1: 0.38 ohm; Material: ?; MountType: SMT; Green_EU RoHS-2: Passed; Supplier 1: Mouser; Green_EU RoHS: Passed; PackageReference: 2.0x1x1.6mm; CompType: Inductor; LatestRevisionDate: 2017-06-02; PartNumber: MAKK2016T4R7M; AEC Qualified: ?; ComponentLink1Description: Datasheet link; Supplier Part Number 1: 963-MAKK2016T4R7M; Technology: Wirewound
L6 = XFL4020-472MEB: Inductor, Shielded, Composite, 4.7 µH, 2.7 A, 0.05 ohm, SMD; Manufacturer: Coilcraft; Value: 4.7uH; Ind_H: 4.7E-6; Imax_A: 2.7; Irms: 5A @ 40C rise; Isat: 2.7A @ 30% inductance drop; DCR_ohm: 0.05; Value2: 2.7A; AEC Category: Q200; SymbolVersion: 2008-07-23; CompType: Inductor; PartNumber: XFL4020-472MEB; Value1: 0.05 ohm; Technology: Shielded; MountType: SMT; Material: Composite; PackageReference: 4x2x4mm; Published: 2008-06-26; Publisher: Texas Instruments; LatestRevisionDate: 2016-01-18; ComponentLink1Description: Datasheet link; ComponentLink1URL: http://www.coilcraft.com/pdfs/xfl4020.pdf; RoHS: Y; Supplier 1: Mouser; Supplier Part Number 1: 994-XFL4020-472MEB; AEC Qualified: ?
NT1 = Net-Tie: Single point connection between nets.; SymbolCreator: codlsc; SymbolVersion: 2009-07-01; MountType: SMT; PackageReference: N/A; Publisher: Texas Instruments; LatestRevisionDate: 2014-10-27; LatestRevisionNote: Added Alternate PartNumber and Alternate Manufacturer parameters to appropriate components.; PartNumber: Net-Tie
Q5 Q6 = SI7454DDP-T1-GE3: MOSFET, N-CH, 100 V, 21 A, PowerPAK SO-8; Manufacturer: Vishay-Siliconix; Alternate Manufacturer: None; U/M: EA; ChType: N; Value: 100V; VdsMax_V: 100; Value1: 0.047 ohm; Rdson45_ohm: 0.047; Value2: 12.8 nC; QgTyp_nC: 12.8; Vgs_V: 20; IdsMax_A: 21; SizeAreaWB_mm2: 55.131; SizeArea_mm2: 29.351; SizeX_mm: 5.99; SizeY_mm: 4.9; SizeZ_mm: 1.12; AEC Category: Q101; SymbolVersion: 2011-08-16; PartNumber: SI7454DDP-T1-GE3; PackageReference: PowerPAK SO-8; CompType: MOSFET; RoHS: Y; MountType: SMT; Published: 2008-06-19; Publisher: Texas Instruments; LatestRevisionDate: 2016-10-20; LatestRevisionNote: Added parts.; ComponentLink1Description: Datasheet link; ComponentLink1URL: http://www.vishay.com/docs/67883/si7454ddp.pdf; Supplier 1: Digi-Key; Supplier Part Number 1: SI7454DDP-T1-GE3CT-ND; Supplier 2: Mouser; Supplier Part Number 2: 78-SI7454DDP-T1-GE3; Supplier 3: Farnell; Supplier Part Number 3: 2283675; AEC Qualified: N
R163 R176 R201 R203 R205 = CMP-0025874-3: RES, 0, 5%, 0.1 W, 0603; PartNumber: ERJ-3GEY0R00V; Manufacturer: Panasonic; CompType: Resistor; Value: 0; Value_Code: 0000; Power_W: 100mW; Value2: 0.1W; VDC_V: 50V; TempCo: 600 ppm/C; EIA_Code: E24; U/M: EA; AEC Category: Q200; SizeArea_mm2: 1.28; SizeX_mm: 1.6; SizeY_mm: 0.8; SizeZ_mm: 1; PackageReference: 0603; RoHS: Y; Res_ohm: 0; Tolerance_%: 5%; Value1: 5%; MountType: SMT; Technology: Thick Film; Published: 2008-06-26; Publisher: Texas Instruments; LatestRevisionDate: 2017-03-09; ComponentLink1Description: Datasheet link; ComponentLink1URL: http://www.panasonic.com/industrial/components/pdf/AOA0000CE1.pdf; Supplier 1: Digi-Key; Supplier Part Number 1: P0.0GCT-ND; Supplier 2: Mouser; Supplier Part Number 2: 667-ERJ-3GEY0R00V; Supplier 3: Farnell; Supplier Part Number 3: 2059527; AEC Qualified: ?
R179 R180 R182 R183 R209 = CRCW06034K99FKEA: RES, 4.99 k, 1%, 0.1 W, 0603; Manufacturer: Vishay-Dale; CompType: Resistor; Value: 4.99k; Res_ohm: 4990; Value_Code: 4k99; Tolerance_%: 1; Power_W: 0.1; Value2: 0.1W; VDC_V: 75; TempCo: 100 ppm/C; EIA_Code: E96; U/M: EA; SymbolVersion: 2009-05-29; PartNumber: CRCW06034K99FKEA; PackageReference: 0603; RoHS: Y; Value1: 1%; MountType: SMT; Technology: Thick Film; Published: 2008-06-26; Publisher: Texas Instruments; LatestRevisionDate: 2015-06-13; ComponentLink1Description: Datasheet link; ComponentLink1URL: http://www.vishay.com/docs/20035/dcrcwe3.pdf; Supplier 1: Digi-Key; Supplier Part Number 1: 541-4.99KHCT-ND; Supplier 2: Mouser; Supplier Part Number 2: 71-CRCW0603-4.99K-E3; Supplier 3: Farnell; Supplier Part Number 3: 1652885
R188 R189 = CRCW04020000Z0ED: RES, 0, 5%, 0.063 W, 0402; Manufacturer: Vishay-Dale; CompType: Resistor; Value: 0; Value_Code: 0000; Tolerance_%: 5; Power_W: 0.063; Value2: 0.063W; VDC_V: 50; TempCo: 200 ppm/C; SizeArea_mm2: 0.5; SizeX_mm: 1; SizeZ_mm: 0.6; EIA_Code: E24; U/M: EA; AEC Category: Q200; Green_Lifecycle: Active; Green_REACh: Passed; SymbolVersion: 2009-05-29; PartNumber: CRCW04020000Z0ED; PackageReference: 0402; RoHS: Y; Res_ohm: 0; Value1: 5%; MountType: SMT; Technology: Thick Film; SizeY_mm: 0.5; Published: 2008-06-26; Publisher: Texas Instruments; LatestRevisionDate: 2017-06-12; ComponentLink1Description: Datasheet link; ComponentLink1URL: http://www.vishay.com/docs/20035/dcrcwe3.pdf; Supplier 1: Digi-Key; Supplier Part Number 1: 541-0.0JCT-ND; Supplier 2: Newark; Supplier Part Number 2: 52K6543; Supplier 3: Mouser; Supplier Part Number 3: 71-CRCW0402-0-E3; AEC Qualified: ?; Green_EU RoHS: Passed with Exemption; Green_EU RoHS-2: Passed
R190 R191 R194 R195 = Resistor: RES, 10.0 k, 1%, 0.1 W, 0603; Manufacturer: Yageo; Power_W: 100mW; TempCo: 100 ppm/C; Value_Code: 10k0; Value: 10.0k; EIA_Code: E96; Res_ohm: 10k; SizeX_mm: 1.6; SizeY_mm: 0.8; SizeZ_mm: 1; Value2: 0.1W; SizeArea_mm2: 1.28; AEC Qualified: N; VDC_V: 75V; AEC Category: Q200; SizeAreaWB_mm2: 4.68; Supplier Part Number 2: 603-RC0603FR-0710KL; Supplier 2: Mouser; Supplier Part Number 3: 9238603; Supplier 3: Farnell; RoHS: Y; Value1: 1%; MountType: SMT; Supplier 1: Digi-Key; PackageReference: 0603; Tolerance_%: 1%; CompType: Resistor; PartNumber: RC0603FR-0710KL; ComponentLink1Description: Datasheet link; Supplier Part Number 1: 311-10.0KHRCT-ND; Technology: Thick Film; ComponentLink1URL: http://www.yageo.com/pdf/Pu-RC0603_51_PbFree_L_2.pdf; AEC Grade: N/A
R196 = CRCW040249R9FKED: RES, 49.9, 1%, 0.063 W, 0402; Manufacturer: Vishay-Dale; CompType: Resistor; Value: 49.9; Value_Code: 49R9; Tolerance_%: 1; Power_W: 0.063; Value2: 0.063W; VDC_V: 50; TempCo: 100 ppm/C; SizeArea_mm2: 0.5; SizeZ_mm: 0.6; EIA_Code: E96; U/M: EA; AEC Category: Q200; Green_Lifecycle: Active; Green_REACh: Passed; SymbolVersion: 2009-05-29; PartNumber: CRCW040249R9FKED; PackageReference: 0402; RoHS: Y; Res_ohm: 49.9; Value1: 1%; MountType: SMT; Technology: Thick Film; SizeX_mm: 1; SizeY_mm: 0.5; Published: 2008-06-26; Publisher: Texas Instruments; LatestRevisionDate: 2017-06-12; ComponentLink1Description: Datasheet link; ComponentLink1URL: http://www.vishay.com/docs/20035/dcrcwe3.pdf; Supplier 1: Digi-Key; Supplier Part Number 1: 541-49.9LCT-ND; Supplier 2: Newark; Supplier Part Number 2: 52K7114; Supplier 3: Mouser; Supplier Part Number 3: 71-CRCW0402-49.9-E3; AEC Qualified: ?; Green_EU RoHS: Passed with Exemption; Green_EU RoHS-2: Passed
R197 = CRCW0402130KFKED: RES, 130 k, 1%, 0.063 W, 0402; Manufacturer: Vishay-Dale; CompType: Resistor; Value: 130k; Res_ohm: 130000; Tolerance_%: 1; Power_W: 0.063; Value2: 0.063W; VDC_V: 50; TempCo: 100 ppm/C; SizeArea_mm2: 0.5; SizeZ_mm: 0.6; EIA_Code: E96; U/M: EA; AEC Category: Q200; Green_Lifecycle: Active; Green_REACh: Passed; SymbolVersion: 2009-05-29; PartNumber: CRCW0402130KFKED; PackageReference: 0402; RoHS: Y; Value_Code: 130k; Value1: 1%; MountType: SMT; Technology: Thick Film; SizeX_mm: 1; SizeY_mm: 0.5; Published: 2008-06-26; Publisher: Texas Instruments; LatestRevisionDate: 2017-06-12; ComponentLink1Description: Datasheet link; ComponentLink1URL: http://www.vishay.com/docs/20035/dcrcwe3.pdf; Supplier 1: Digi-Key; Supplier Part Number 1: 541-130KLCT-ND; Supplier 2: Newark; Supplier Part Number 2: 52K6678; Supplier 3: Mouser; Supplier Part Number 3: 71-CRCW0402-130K-E3; AEC Qualified: ?; Green_EU RoHS: Passed with Exemption; Green_EU RoHS-2: Passed
R198 R200 = CRCW0402100KDHEDP: RES, 100 k, 0.5%, 0.063 W, 0402; Manufacturer: Vishay-Dale; CompType: Resistor; Value: 100k; Res_ohm: 100000; Tolerance_%: 0.5; Power_W: 0.063; Value2: 0.063W; VDC_V: 50; TempCo: 50 ppm/C; SizeX_mm: 1; SizeZ_mm: 0.6; EIA_Code: E192; U/M: EA; AEC Category: Q200; Green_Lifecycle: Active; Green_REACh: Passed; SymbolVersion: 2009-05-29; PartNumber: CRCW0402100KDHEDP; PackageReference: 0402; RoHS: Y; Value_Code: 100k; Value1: 0.5%; MountType: SMT; Technology: Thick Film; SizeArea_mm2: 0.5; SizeY_mm: 0.5; Published: 2008-06-26; Publisher: Texas Instruments; LatestRevisionDate: 2017-06-12; ComponentLink1Description: Datasheet link; ComponentLink1URL: http://www.vishay.com/docs/20036/dcrcwpe3.pdf; Supplier 1: Digi-Key; Supplier Part Number 1: 541-100KAVCT-ND; AEC Qualified: ?; Green_EU RoHS: Passed with Exemption; Green_EU RoHS-2: Passed
R199 = CRCW040224K0JNED: RES, 24 k, 5%, 0.063 W, 0402; Manufacturer: Vishay-Dale; CompType: Resistor; Value: 24k; Res_ohm: 24000; Value_Code: 24k0; Tolerance_%: 5; Power_W: 0.063; Value2: 0.063W; VDC_V: 50; TempCo: 200 ppm/C; SizeArea_mm2: 0.5; SizeX_mm: 1; SizeZ_mm: 0.6; EIA_Code: E24; U/M: EA; AEC Category: Q200; Green_Lifecycle: Active; Green_REACh: Passed; SymbolVersion: 2009-05-29; PartNumber: CRCW040224K0JNED; PackageReference: 0402; RoHS: Y; Value1: 5%; MountType: SMT; Technology: Thick Film; SizeY_mm: 0.5; Published: 2008-06-26; Publisher: Texas Instruments; LatestRevisionDate: 2017-06-12; ComponentLink1Description: Datasheet link; ComponentLink1URL: http://www.vishay.com/docs/20035/dcrcwe3.pdf; Supplier 1: Digi-Key; Supplier Part Number 1: 541-24KJCT-ND; AEC Qualified: ?; Green_EU RoHS: Passed with Exemption; Green_EU RoHS-2: Passed
R202 = Resistor: RES, 100 k, 1%, 0.1 W, 0603; Manufacturer: Vishay-Dale; Power_W: 100mW; TempCo: 100 ppm/C; U/M: EA; Value: 100k; EIA_Code: E96; SizeX_mm: 1.6; SizeY_mm: 0.8; SizeZ_mm: 1; Value2: 0.1W; SizeArea_mm2: 1.28; VDC_V: 75V; AEC Category: Q200; ComponentLink1URL: http://www.vishay.com/docs/20035/dcrcwe3.pdf; Supplier Part Number 2: 42K3668; Publisher: Texas Instruments; Supplier 2: Newark; Supplier Part Number 3: 71-CRCW0603-100K-E3; Supplier 3: Mouser; Published: 2008-06-26; Value_Code: 100k; RoHS: Y; Value1: 1%; MountType: SMT; Supplier 1: Digi-Key; PackageReference: 0603; Tolerance_%: 1%; Res_ohm: 100k; CompType: Resistor; LatestRevisionDate: 2017-03-09; PartNumber: CRCW0603100KFKEA; AEC Qualified: ?; ComponentLink1Description: Datasheet link; Supplier Part Number 1: 541-100KHCT-ND; Technology: Thick Film
R206 = CRCW060320K0FKEA: RES, 20.0 k, 1%, 0.1 W, 0603; Manufacturer: Vishay-Dale; CompType: Resistor; Value: 20.0k; Res_ohm: 20000; Value_Code: 20k0; Tolerance_%: 1; Power_W: 0.1; Value2: 0.1W; VDC_V: 75; TempCo: 100 ppm/C; EIA_Code: E96; U/M: EA; AEC Category: Q200; SymbolVersion: 2009-05-29; PartNumber: CRCW060320K0FKEA; PackageReference: 0603; RoHS: Y; Value1: 1%; MountType: SMT; Technology: Thick Film; Published: 2008-06-26; Publisher: Texas Instruments; LatestRevisionDate: 2015-08-22; ComponentLink1Description: Datasheet link; ComponentLink1URL: http://www.vishay.com/docs/20035/dcrcwe3.pdf; Supplier 1: Digi-Key; Supplier Part Number 1: 541-20.0KHCT-ND; Supplier 2: Mouser; Supplier Part Number 2: 71-CRCW0603-20K-E3; Supplier 3: Farnell; Supplier Part Number 3: 1469774; AEC Qualified: ?
R207 = Resistor: RES, 100 k, 1%, 0.1 W, 0603; Manufacturer: Yageo; Power_W: 100mW; TempCo: 100 ppm/C; Value: 100k; EIA_Code: E96; SizeX_mm: 1.6; SizeY_mm: 0.8; SizeZ_mm: 1; Value2: 0.1W; SizeArea_mm2: 1.28; AEC Qualified: N; VDC_V: 75V; AEC Category: Q200; SizeAreaWB_mm2: 4.68; Supplier Part Number 2: 603-RC0603FR-07100KL; Supplier 2: Mouser; Supplier Part Number 3: 9238727; Supplier 3: Farnell; Value_Code: 100k; RoHS: Y; Value1: 1%; MountType: SMT; Supplier 1: Digi-Key; PackageReference: 0603; Tolerance_%: 1%; Res_ohm: 100k; CompType: Resistor; PartNumber: RC0603FR-07100KL; ComponentLink1Description: Datasheet link; Supplier Part Number 1: 311-100KHRCT-ND; Technology: Thick Film; ComponentLink1URL: http://www.yageo.com/pdf/Pu-RC0603_51_PbFree_L_2.pdf; AEC Grade: N/A
R208 = CRCW060349K9FKEA: RES, 49.9 k, 1%, 0.1 W, 0603; Manufacturer: Vishay-Dale; CompType: Resistor; Value: 49.9k; Res_ohm: 49900; Value_Code: 49k9; Tolerance_%: 1; Power_W: 0.1; Value2: 0.1W; VDC_V: 75; TempCo: 100 ppm/C; SizeArea_mm2: 1.28; SizeX_mm: 1.6; SizeY_mm: 0.8; EIA_Code: E96; U/M: EA; AEC Category: Q200; Green_Lifecycle: Active; Green_REACh: Passed; SymbolVersion: 2009-05-29; PartNumber: CRCW060349K9FKEA; PackageReference: 0603; RoHS: Y; Value1: 1%; MountType: SMT; Technology: Thick Film; SizeZ_mm: 1; Published: 2008-06-26; Publisher: Texas Instruments; LatestRevisionDate: 2017-06-13; ComponentLink1Description: Datasheet link; ComponentLink1URL: http://www.vishay.com/docs/20035/dcrcwe3.pdf; Supplier 1: Digi-Key; Supplier Part Number 1: 541-49.9KHCT-ND; Supplier 2: Mouser; Supplier Part Number 2: 71-CRCW0603-49.9K-E3; Supplier 3: Farnell; Supplier Part Number 3: 1652882; AEC Qualified: ?; Green_EU RoHS: Passed with Exemption; Green_EU RoHS-2: Passed
R210 = CRCW060318K2FKEA: RES, 18.2 k, 1%, 0.1 W, 0603; Manufacturer: Vishay-Dale; CompType: Resistor; Value: 18.2k; Res_ohm: 18200; Value_Code: 18k2; Tolerance_%: 1; Power_W: 0.1; Value2: 0.1W; VDC_V: 75; TempCo: 100 ppm/C; EIA_Code: E96; U/M: EA; SymbolVersion: 2009-05-29; PartNumber: CRCW060318K2FKEA; PackageReference: 0603; RoHS: Y; Value1: 1%; MountType: SMT; Technology: Thick Film; Published: 2008-06-26; Publisher: Texas Instruments; LatestRevisionDate: 2014-10-21; ComponentLink1Description: Datasheet link; ComponentLink1URL: http://www.vishay.com/docs/20035/dcrcwe3.pdf; Supplier 1: Digi-Key; Supplier Part Number 1: 541-18.2KHCT-ND; Supplier 2: Mouser; Supplier Part Number 2: 71-CRCW0603-18.2K-E3; Supplier 3: Farnell; Supplier Part Number 3: 1652845
R211 = PRL1632-R068-F-T1: RES, 0.068, 1%, 1 W, 0612; Manufacturer: Susumu Co Ltd; CompType: Resistor; Value: 0.068; Value_Code: R068; Tolerance_%: 1; Value2: 1W; TempCo: 50 ppm/C; U/M: EA; SymbolVersion: 2009-05-29; PartNumber: PRL1632-R068-F-T1; PackageReference: 0612; RoHS: Y; Res_ohm: 0.068; Value1: 1%; Power_W: 1; MountType: SMT; Technology: Thin Film; Published: 2008-06-26; Publisher: Texas Instruments; LatestRevisionDate: 2014-11-30; ComponentLink1Description: Datasheet link; ComponentLink1URL: http://www.susumu-usa.com/common/pdf/PRL_RL_Data_sheet.pdf; Supplier 1: Digi-Key; Supplier Part Number 1: PRL1632.068FCT-ND; Supplier 2: Mouser; Supplier Part Number 2: 754-PRL1632-R068-FT1
R212 = RC0603FR-0724KL: RES, 24.0 k, 1%, 0.1 W, 0603; Manufacturer: Yageo America; CompType: Resistor; Value: 24.0k; Res_ohm: 24000; Value_Code: 24k0; Tolerance_%: 1; Power_W: 0.1; Value2: 0.1W; VDC_V: 150; TempCo: 200 ppm/C; U/M: EA; SymbolVersion: 2009-05-29; PartNumber: RC0603FR-0724KL; PackageReference: 0603; RoHS: Y; Value1: 1%; MountType: SMT; Technology: Thick Film; Published: 2008-06-26; Publisher: Texas Instruments; LatestRevisionDate: 2014-10-21; ComponentLink1Description: Datasheet link; ComponentLink1URL: http://www.yageo.com/pdf/Pu-RC0603_51_PbFree_L_2.pdf; Supplier 1: Digi-Key; Supplier Part Number 1: 311-24.0KHRCT-ND; Supplier 2: Mouser; Supplier Part Number 2: 603-RC0603FR-0724KL; Supplier 3: Farnell; Supplier Part Number 3: 1799336
R213 = CMP-0023278-3: RES, 7.32 k, 1%, 0.1 W, 0603; Manufacturer: Yageo America; Power_W: 100mW; TempCo: 200 ppm/C; Value_Code: 7k32; U/M: EA; Value: 7.32k; EIA_Code: E96; SizeX_mm: 1.6; SizeY_mm: 0.8; SizeZ_mm: 1; Value2: 0.1W; SizeArea_mm2: 1.28; CompType: Resistor; VDC_V: 150V; AEC Category: Q200; Supplier Part Number 2: 603-RC0603FR-077K32L; Publisher: Texas Instruments; Supplier 2: Mouser; Supplier Part Number 3: 1799353; Supplier 3: Farnell; Published: 2008-06-26; RoHS: Y; Value1: 1%; MountType: SMT; Supplier 1: Digi-Key; PackageReference: 0603; Tolerance_%: 1%; Res_ohm: 7.32k; LatestRevisionDate: 2017-03-09; PartNumber: RC0603FR-077K32L; AEC Qualified: ?; ComponentLink1Description: Datasheet link; Supplier Part Number 1: 311-7.32KHRCT-ND; Technology: Thick Film; ComponentLink1URL: http://www.yageo.com/pdf/Pu-RC0603_51_PbFree_L_2.pdf
R214 = CMP-0023172-3: RES, 52.3 k, 1%, 0.1 W, 0603; Manufacturer: Yageo America; Power_W: 100mW; TempCo: 200 ppm/C; Value_Code: 52k3; U/M: EA; Value: 52.3k; EIA_Code: E96; SizeX_mm: 1.6; SizeY_mm: 0.8; SizeZ_mm: 1; Value2: 0.1W; SizeArea_mm2: 1.28; CompType: Resistor; VDC_V: 150V; AEC Category: Q200; Supplier Part Number 2: 603-RC0603FR-0752K3L; Publisher: Texas Instruments; Supplier 2: Mouser; Published: 2008-06-26; RoHS: Y; Value1: 1%; MountType: SMT; Supplier 1: Digi-Key; PackageReference: 0603; Tolerance_%: 1%; Res_ohm: 52.3k; LatestRevisionDate: 2017-03-09; PartNumber: RC0603FR-0752K3L; AEC Qualified: ?; ComponentLink1Description: Datasheet link; Supplier Part Number 1: 311-52.3KHRCT-ND; Technology: Thick Film; ComponentLink1URL: http://www.yageo.com/pdf/Pu-RC0603_51_PbFree_L_2.pdf
R215 = CRCW060310R0FKEA: RES, 10.0, 1%, 0.1 W, 0603; Manufacturer: Vishay-Dale; CompType: Resistor; Value: 10.0; Res_ohm: 10; Value_Code: 10R0; Tolerance_%: 1; Power_W: 0.1; Value2: 0.1W; VDC_V: 75; TempCo: 100 ppm/C; EIA_Code: E96; U/M: EA; SymbolVersion: 2009-05-29; PartNumber: CRCW060310R0FKEA; PackageReference: 0603; RoHS: Y; Value1: 1%; MountType: SMT; Technology: Thick Film; Published: 2008-06-26; Publisher: Texas Instruments; LatestRevisionDate: 2014-10-21; ComponentLink1Description: Datasheet link; ComponentLink1URL: http://www.vishay.com/docs/20035/dcrcwe3.pdf; Supplier 1: Digi-Key; Supplier Part Number 1: 541-10.0HCT-ND; Supplier 2: Mouser; Supplier Part Number 2: 71-CRCW0603-10-E3; Supplier 3: Farnell; Supplier Part Number 3: 1469751
S3 = L101011MS02Q: SWITCH SLIDE SPST 4A PCB, TH; Manufacturer: C&K Components; Symbol Creator: a0411947; VDC_V: 125; SwitchFunction: Off-On; PositionCount: 1; CurrentRating_mA: 4000; Symbol Version: 2013-04-17; PartNumber: L101011MS02Q; MountType: TH; ComponentLink1Description: Datasheet URL; ComponentLink1URL: https://sps06.itg.ti.com/sites/KMS/crossdivteams/altium/docs/ComponentDatasheets/L_17may12.pdf; RoHS: Y; Circuit: SPST; Orientation: Vertical; CompType: Switch; PackageReference: Slide Switch, TH, SPST; Publisher: Texas Instruments; LatestRevisionDate: 2017-04-05; Supplier 1: Digi-Key; Supplier Part Number 1: CKC5106-ND; Supplier 2: Newark; Supplier Part Number 2: 40M0406; Supplier 3: Mouser; Supplier Part Number 3: 611-L101011MS02Q
SH-J4 = 60900213421: Shunt, 2.54mm, Gold, Black; Manufacturer: Wurth Elektronik; Green_Lifecycle: Active; Green_REACh: Passed; CompType: Shunt; PartNumber: 60900213421; RoHS: Y; PackageReference: Shunt, 2.54mm, Black; MountType: N/A; ComponentLink1Description: Datasheet Link; ComponentLink1URL: http://katalog.we-online.de/em/datasheet/60900213421.pdf; Publisher: Texas Instruments; LatestRevisionDate: 2017-06-22; Supplier 1: Digi-Key; Supplier Part Number 1: 732-2678-ND; Supplier 2: Newark; Supplier Part Number 2: 16T0609; Supplier 3: Mouser; Supplier Part Number 3: 710-60900213421; Green_EU RoHS: Passed; Green_EU RoHS-2: Incomplete
TP24-TP29 TP32 TP33 = 5000: Test Point, Miniature, Red, TH; Manufacturer: Keystone; CompType: Test Point Loop; ContactFinish: Silver; Green_Lifecycle: Active; Green_REACh: Passed; SymbolVersion: 2008-04-04; PartNumber: 5000; PackageReference: Red Miniature Testpoint; RoHS: Y; MountType: TH; ComponentLink1Description: Datasheet URL; ComponentLink1URL: http://www.keyelco.com/userAssets/file/M60-2p60.pdf; Color: Red; Publisher: Texas Instruments; LatestRevisionDate: 2017-05-11; Supplier 1: Digi-Key; Supplier Part Number 1: 36-5000-ND; Supplier 2: Mouser; Supplier Part Number 2: 534-5000; Green_EU RoHS: Passed; Green_EU RoHS-2: Incomplete
TP34-TP36 = 5001: Test Point, Miniature, Black, TH; Manufacturer: Keystone; CompType: Test Point Loop; ContactFinish: Silver; Green_Lifecycle: Active; Green_REACh: Passed; SymbolVersion: 2008-04-04; PartNumber: 5001; PackageReference: Black Miniature Testpoint; RoHS: Y; MountType: TH; ComponentLink1Description: Datasheet URL; ComponentLink1URL: http://www.keyelco.com/userAssets/file/M60-2p60.pdf; Color: Black; Publisher: Texas Instruments; LatestRevisionDate: 2017-05-11; Supplier 1: Digi-Key; Supplier Part Number 1: 36-5001-ND; Supplier 2: Mouser; Supplier Part Number 2: 534-5001; Green_EU RoHS: Passed; Green_EU RoHS-2: Incomplete
U20 = LP5907: 250-mA Ultra-Low-Noise, Low-IQ LDO, DBV0005A (SOT-23-5); Alternate Manufacturer: Texas Instruments; Green_Lifecycle: Active; SizeAreaWB_mm2: 14.82; Green_REACh: Passed; U/M: EA; SizeZ_mm: 1.45; SizeX_mm: 2.8; SizeY_mm: 2.9; SizeArea_mm2: 8.12; CompType: IC; ComponentLink1URL: http://www.ti.com/lit/ds/symlink/lp5907.pdf; Publisher: Texas Instruments; PackageDescription: SOT-23-5; RoHS: Y; Footprint Path 6: C:\AltiumLibraries\Footprints\TI\.PcbLib; MountType: SMT; Green_EU RoHS-2: Passed; Manufacturer: Texas Instruments; Green_EU RoHS: Passed; PackageReference: DBV0005A; LatestRevisionDate: 2017-06-09; PartNumber: LP5907MFX-3.3/NOPB; ComponentLink1Description: Datasheet Link
U21 = TPS63710DRR: Synchronous Inverting Buck Converter, DRR0012C; Manufacturer: Texas Instruments; SymbolCreator: Altium; SizeArea_mm2: 9; SizeAreaWB_mm2: 16; SizeX_mm: 3; SizeZ_mm: 0.8; CompType: IC; U/M: EA; SymbolVersion: 2016-03-03; PartNumber: TPS63710DRR; PackageReference: DRR0012C; PackageDescription: WSON-12; MountType: SMT; SizeY_mm: 3; ComponentLink1Description: Datasheet Link; ComponentLink1URL: https://sps06.itg.ti.com/sites/KMS/crossdivteams/altium/docs/ComponentDatasheets/TPS63710_Datasheet_2March2016.pdf; Publisher: Texas Instruments; LatestRevisionDate: 2016-06-29; Alternate Manufacturer: Texas Instruments
U22 U31 = PM-REG-LP38692-SOT5: 500mA Low Dropout CMOS Linear Regulators Stable with Ceramic Output Capacitors, 5-pin SOT-223, Pb-Free, 1000 Reel; Manufacturer: Texas Instruments; CompType: LDO IC; PowerWise: Y; PackageTopMarking: XYTT*LJZB; PackageDescription: Moldec SOT-223, 6.50 x 3.56 x 1.6mm Body, 5 Lead, 1.5mm Pitch; RoHS: Y; ComponentLink1Description: Datasheet URL; ComponentLink1URL: http://www.ti.com/general/docs/lit/getliterature.tsp?genericPartNumber=LP38693&fileType=pdf; PartNumber: LP38693MP-5.0/NOPB; PackageReference: NDC0005A; PinCount: 5; High-Reliability: Y; Code_IPC: SOT223-5; Code_JEDEC: TO-261-AB
U23 = LM5118MH/NOPB: Wide Voltage Range Buck-Boost Controller, 20-pin TSSOP-EP, Pb-Free; Manufacturer: Texas Instruments; PackageTopMarking: NSUZXYTT*LM5118*MH; PowerWise: Y; CompType: Switcher; Published: 1-Mar-2010; DatasheetVersion: Jul-2009; PackageVersion: revC, Jul-2006; PackageReference: MXA20A; Publisher: Altium Limited; PackageDescription: Molded TSSOP, Jedec, 6.5 x 4.4 x 0.9mm Body, 20 Lead, 0.65mm Pitch, Exposed Pad; Supplier 1: Digi-Key; Supplier Part Number 1: LM5118MH-ND; PartNumber: LM5118MH/NOPB; RoHS: Y; PinCount: 20; Code_JEDEC: MO-153-ACT; ComponentLink1Description: LM5118 Datasheet; ComponentLink1URL: http://www.national.com/ds/LM/LM5118.pdf; ComponentLink2Description: LM5118 Web Page; ComponentLink2URL: http://www.national.com/pf/LM/LM5118.html; ComponentLink3Description: MXA20A Package Page; ComponentLink3URL: http://www.national.com/packaging/folders/mxa20a.html
U25 = TPS736xxDBV: Single Output Low Noise LDO, 400 mA, Fixed 3.3 V Output, 1.7 to 5.5 V Input, with Reverse Current Protection, 5-pin SOT-23 (DBV), -40 to 85 degC, Green (RoHS & no Sb/Br); Manufacturer: Texas Instruments; Alternate PartNumber: TPS73633DBVT; Vout Adj(Min)(V): 3.3; Rating: Catalog; Accuracy(%): 1; Iq(Typ)(mA): 0.3; Vin(Max)(V): 5.5; SubFamily: Single Channel LDO; Vdo(Typ)(mV): 75; Vin(Min)(V): 1.7; Iout(Max)(A): 0.4; AEC Category: Q200; AEC Qualified: N; CompType: IC; Green_Lifecycle: Active; Green_REACh: Passed; SizeAreaWB_mm2: 14.82; SizeArea_mm2: 8.12; SizeX_mm: 2.8; SizeY_mm: 2.9; SizeZ_mm: 1.45; ComponentLink3Description: Online Datasheet; PackageDescription: SOT-23-5; PartNumber: TPS73633DBVR; Eco-Plan: Green (RoHS & no Sb/Br); PackageReference: DBV0005A; ComponentLink2URL: http://www.ti.com/product/tps736; ComponentLink1URL: http://www.ti.com/lit/ds/symlink/tps736.pdf; Fixed Output Options(V): 3.3; PackageVersion: 4073253-4/K; ComponentLink3URL: http://www.ti.com/product/tps736/datasheet; DatasheetVersion: SBVS038T; Code_JEDEC: MO-178; ComponentLink1Description: Datasheet Link; ComponentLink2Description: Product Folder; Vout Adj(Max)(V): 3.3; Alternate Manufacturer: Texas Instruments; Green_EU RoHS: Passed; Green_EU RoHS-2: Passed; MountType: SMT; RoHS: Y; Supplier 1: Digi-Key; Supplier 2: Digi-Key